# Altium schematic sheet NucleoClone_Top.SchDoc: mb1319 Top: hierarchical view
size A4; Date: Not used; ApprovedBy: Not used; CheckedBy: Not used; Author: Not used; CompanyName: STMicroelectronics; DrawnBy: Not used; Engineer: Not used; Organization: Not used; Address1: Not used; Address2: Not used; Address3: Not used; Address4: Not used; DocumentNumber: 2; Revision: Not used; SheetNumber: 2; SheetTotal: 9; CurrentTime: Not used; CurrentDate: Not used; Time: Not used; DocumentFullPathAndName: Not used; DocumentName: Not used; ModifiedDate: Not used; ImagePath: Not used; ProjectName: Not used; Application_BuildNumber: Not used
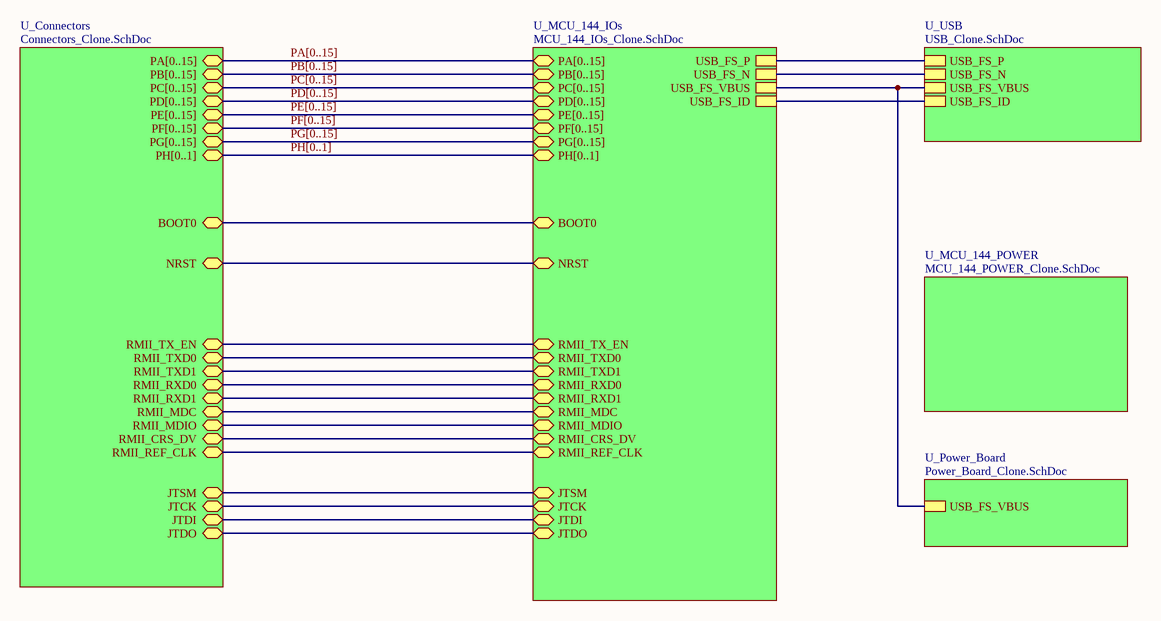
[diagram p0: NucleoClone_Top.SchDoc]

## Sub-sheets
U_Connectors = Connectors_Clone.SchDoc: PA[0..15] (bidir), PB[0..15] (bidir), PC[0..15] (bidir), PD[0..15] (bidir), PE[0..15] (bidir), PH[0..1] (bidir), PF[0..15] (bidir), PG[0..15] (bidir), JTSM (bidir), JTCK (bidir), JTDI (bidir), JTDO (bidir), RMII_TX_EN (bidir), RMII_TXD0 (bidir), RMII_TXD1 (bidir), RMII_RXD0 (bidir), RMII_RXD1 (bidir), RMII_MDC (bidir), RMII_MDIO (bidir), RMII_CRS_DV (bidir), RMII_REF_CLK (bidir), NRST (bidir), BOOT0 (bidir)
U_MCU_144_IOs = MCU_144_IOs_Clone.SchDoc: NRST (bidir), BOOT0 (bidir), RMII_TX_EN (bidir), RMII_MDC (bidir), RMII_TXD0 (bidir), RMII_TXD1 (bidir), RMII_REF_CLK (bidir), RMII_RXD1 (bidir), RMII_MDIO (bidir), RMII_CRS_DV (bidir), RMII_RXD0 (bidir), USB_FS_N, USB_FS_P, USB_FS_VBUS, USB_FS_ID, PA[0..15] (bidir), PB[0..15] (bidir), PC[0..15] (bidir), PD[0..15] (bidir), PE[0..15] (bidir), PH[0..1] (bidir), PG[0..15] (bidir), PF[0..15] (bidir), JTSM (bidir), JTCK (bidir), JTDI (bidir), JTDO (bidir)
U_MCU_144_POWER = MCU_144_POWER_Clone.SchDoc: no entries
U_Power_Board = Power_Board_Clone.SchDoc: USB_FS_VBUS
U_USB = USB_Clone.SchDoc: USB_FS_VBUS, USB_FS_N, USB_FS_P, USB_FS_ID

## Nets
(unnamed): sheet U_Connectors/JTSM, sheet U_MCU_144_IOs/JTSM
(unnamed): sheet U_Connectors/JTCK, sheet U_MCU_144_IOs/JTCK
(unnamed): sheet U_Connectors/JTDI, sheet U_MCU_144_IOs/JTDI
(unnamed): sheet U_Connectors/JTDO, sheet U_MCU_144_IOs/JTDO
(unnamed): sheet U_Connectors/RMII_TX_EN, sheet U_MCU_144_IOs/RMII_TX_EN
(unnamed): sheet U_Connectors/RMII_TXD0, sheet U_MCU_144_IOs/RMII_TXD0
(unnamed): sheet U_Connectors/RMII_TXD1, sheet U_MCU_144_IOs/RMII_TXD1
(unnamed): sheet U_Connectors/RMII_RXD0, sheet U_MCU_144_IOs/RMII_RXD0
(unnamed): sheet U_Connectors/RMII_RXD1, sheet U_MCU_144_IOs/RMII_RXD1
(unnamed): sheet U_Connectors/RMII_MDC, sheet U_MCU_144_IOs/RMII_MDC
(unnamed): sheet U_Connectors/RMII_MDIO, sheet U_MCU_144_IOs/RMII_MDIO
(unnamed): sheet U_Connectors/RMII_CRS_DV, sheet U_MCU_144_IOs/RMII_CRS_DV
(unnamed): sheet U_Connectors/RMII_REF_CLK, sheet U_MCU_144_IOs/RMII_REF_CLK
(unnamed): sheet U_Connectors/NRST, sheet U_MCU_144_IOs/NRST
(unnamed): sheet U_Connectors/BOOT0, sheet U_MCU_144_IOs/BOOT0
(unnamed): sheet U_Power_Board/USB_FS_VBUS, sheet U_MCU_144_IOs/USB_FS_VBUS, sheet U_USB/USB_FS_VBUS
(unnamed): sheet U_MCU_144_IOs/USB_FS_N, sheet U_USB/USB_FS_N
(unnamed): sheet U_MCU_144_IOs/USB_FS_P, sheet U_USB/USB_FS_P
(unnamed): sheet U_MCU_144_IOs/USB_FS_ID, sheet U_USB/USB_FS_ID

## Buses and harness runs
bus PA[0..15] = sheet U_Connectors/PA[0..15] = sheet U_MCU_144_IOs/PA[0..15]
bus PB[0..15] = sheet U_Connectors/PB[0..15] = sheet U_MCU_144_IOs/PB[0..15]
bus PC[0..15] = sheet U_Connectors/PC[0..15] = sheet U_MCU_144_IOs/PC[0..15]
bus PD[0..15] = sheet U_Connectors/PD[0..15] = sheet U_MCU_144_IOs/PD[0..15]
bus PE[0..15] = sheet U_Connectors/PE[0..15] = sheet U_MCU_144_IOs/PE[0..15]
bus PF[0..15] = sheet U_Connectors/PF[0..15] = sheet U_MCU_144_IOs/PF[0..15]
bus PG[0..15] = sheet U_Connectors/PG[0..15] = sheet U_MCU_144_IOs/PG[0..15]
bus PH[0..1] = sheet U_Connectors/PH[0..1] = sheet U_MCU_144_IOs/PH[0..1]

## Notes on the sheet
- Title:
- Project:
- Size:
- Revision:
- Variant:
- A4
- -
- Date:
- Reference:
- Sheet:
- of